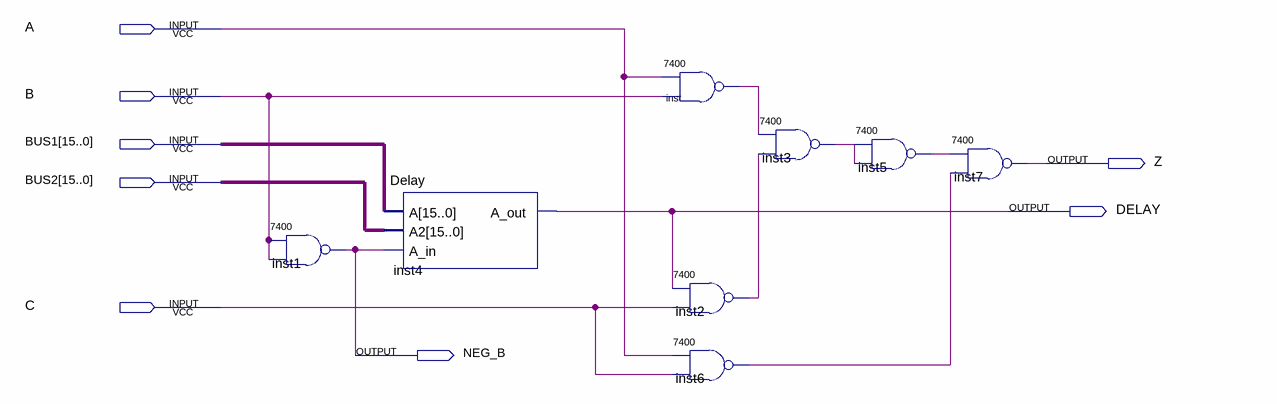
[diagram p0: schematic sheet]
// Quartus schematic redesign.bdf as structural Verilog: 8 symbols, 8 pins
module redesign (
  input  A,
  input  B,
  input  [15:0] BUS1,
  input  [15:0] BUS2,
  input  C,
  output Z,
  output DELAY,
  output NEG_B
);

  wire inst2_1, inst3_1, inst5_1, inst6_1, inst_1;

  \7400  inst1 (.\3 (B), .\2 (B), .\1 (NEG_B));
  Delay inst4 (.A(BUS1), .A2(BUS2), .A_in(NEG_B), .A_out(DELAY));
  \7400  inst (.\3 (B), .\2 (A), .\1 (inst_1));
  \7400  inst2 (.\3 (C), .\2 (DELAY), .\1 (inst2_1));
  \7400  inst6 (.\3 (C), .\2 (A), .\1 (inst6_1));
  \7400  inst3 (.\3 (inst2_1), .\2 (inst_1), .\1 (inst3_1));
  \7400  inst5 (.\3 (inst3_1), .\2 (inst3_1), .\1 (inst5_1));
  \7400  inst7 (.\3 (inst6_1), .\2 (inst5_1), .\1 (Z));
endmodule
